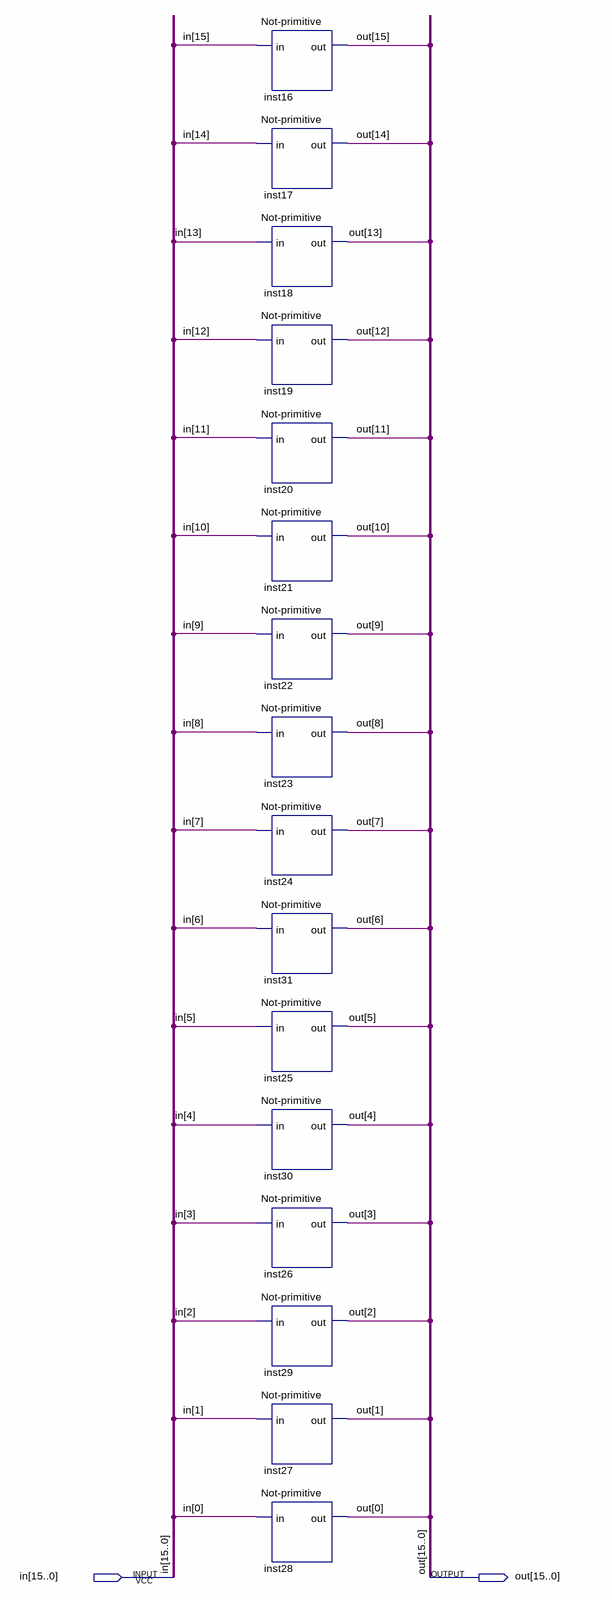
[diagram p0: schematic sheet]
// Quartus schematic Not16.bdf as structural Verilog: 16 symbols, 2 pins
module Not16 (
  input  [15:0] in,
  output [15:0] out
);

  \Not-primitive  inst16 (.in(in[15]), .out(out[15]));
  \Not-primitive  inst17 (.in(in[14]), .out(out[14]));
  \Not-primitive  inst18 (.in(in[13]), .out(out[13]));
  \Not-primitive  inst19 (.in(in[12]), .out(out[12]));
  \Not-primitive  inst20 (.in(in[11]), .out(out[11]));
  \Not-primitive  inst21 (.in(in[10]), .out(out[10]));
  \Not-primitive  inst22 (.in(in[9]), .out(out[9]));
  \Not-primitive  inst23 (.in(in[8]), .out(out[8]));
  \Not-primitive  inst24 (.in(in[7]), .out(out[7]));
  \Not-primitive  inst31 (.in(in[6]), .out(out[6]));
  \Not-primitive  inst25 (.in(in[5]), .out(out[5]));
  \Not-primitive  inst30 (.in(in[4]), .out(out[4]));
  \Not-primitive  inst26 (.in(in[3]), .out(out[3]));
  \Not-primitive  inst29 (.in(in[2]), .out(out[2]));
  \Not-primitive  inst27 (.in(in[1]), .out(out[1]));
  \Not-primitive  inst28 (.in(in[0]), .out(out[0]));
endmodule
